# EAGLE design experiment (EAGLE 9.2.1)

## Sheet 1 of 2

## Sheet 2 of 2
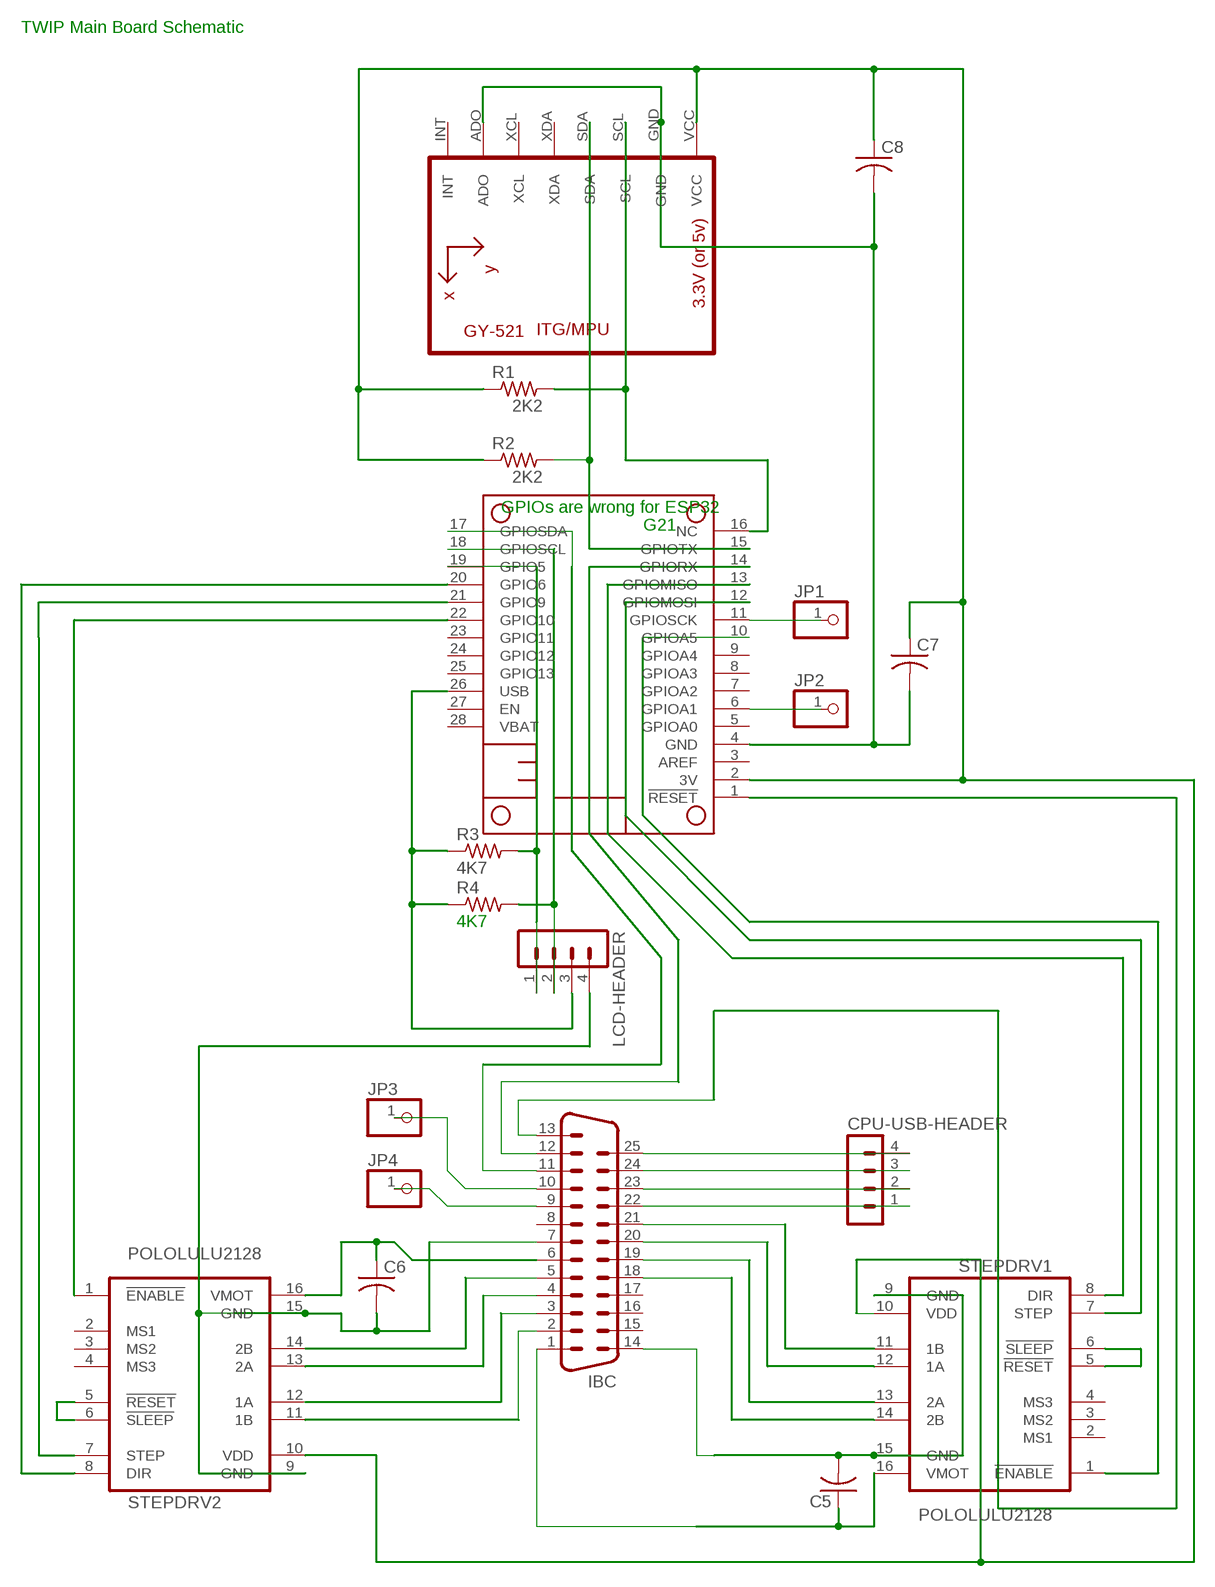
[diagram p0: schematic, sheet 2]

### Parts
C5  C-US050-024X044  [C050-024X044]
C6  C-US050-024X044  [C050-024X044]
C7  C-US050-024X044  [C050-024X044]
C8  C-US050-024X044  [C050-024X044]
CPU-USB-HEADER  MA04-1  [MA04-1]
IBC  M25VP  [M25VP]
JP1  PINHD-1X1  [1X01]
JP2  PINHD-1X1  [1X01]
JP3  PINHD-1X1  [1X01]
JP4  PINHD-1X1  [1X01]
LCD-HEADER  MA04-1  [MA04-1]
MS2  FEATHERWING_NOHOLES  [FEATHERWING_NOHOLES]
R1  2K2  R-US_0309/12  [0309/12]
R2  2K2  R-US_0309/12  [0309/12]
R3  4K7  R-US_0309/12  [0309/12]
R4  4K7  R-US_0309/12  [0309/12]
STEPDRV1  POLOLULU2128  [POLOLULU2128]
STEPDRV2  POLOLULU2128  [POLOLULU2128]
U1  GY-521MPU6050  [GY-521]

### Nets
3V: C7.1 C8.1 MS2.2(3V) R1.1 R2.1 STEPDRV1.10(VDD) STEPDRV2.10(VDD) U1.VCC
N$2: C7.2 C8.2 MS2.4(GND) U1.ADO U1.GND
N$3: IBC.18 STEPDRV1.14(2B)
N$4: IBC.19 STEPDRV1.13(2A)
N$5: MS2.12(GPIOMOSI) STEPDRV1.7(STEP)
N$6: IBC.20 STEPDRV1.12(1A)
N$7: IBC.21 STEPDRV1.11(1B)
N$8: IBC.2 STEPDRV2.11(1B)
N$9: IBC.3 STEPDRV2.12(1A)
N$10: IBC.4 STEPDRV2.13(2A)
N$11: LCD-HEADER.1 MS2.19(GPIO5) R3.2
N$12: IBC.5 STEPDRV2.14(2B)
N$13: CPU-USB-HEADER.4 IBC.25
N$14: CPU-USB-HEADER.3 IBC.24
N$15: MS2.13(GPIOMISO) STEPDRV1.8(DIR)
N$16: IBC.13 MS2.1(!RESET)
N$17: MS2.16(NC) R1.2 U1.SCL
N$18: CPU-USB-HEADER.2 IBC.23
N$19: IBC.12 MS2.14(GPIORX)
N$20: C5.2 IBC.14 STEPDRV1.9(GND) STEPDRV1.15(GND)
N$21: C6.1 IBC.6 STEPDRV2.16(VMOT)
N$22: C5.1 IBC.1 STEPDRV1.16(VMOT)
N$23: STEPDRV1.5(!RESET) STEPDRV1.6(!SLEEP)
N$24: STEPDRV2.5(!RESET) STEPDRV2.6(!SLEEP)
N$25: MS2.15(GPIOTX) R2.2 U1.SDA
N$27: MS2.20(GPIO6) STEPDRV2.8(DIR)
N$28: IBC.11 MS2.17(GPIOSDA)
N$29: MS2.21(GPIO9) STEPDRV2.7(STEP)
N$30: CPU-USB-HEADER.1 IBC.22
N$31: MS2.10(GPIOA5) STEPDRV1.1(!ENABLE)
N$32: JP1.1 MS2.11(GPIOSCK)
N$33: C6.2 IBC.7 LCD-HEADER.4 STEPDRV2.9(GND) STEPDRV2.15(GND)
N$34: MS2.22(GPIO10) STEPDRV2.1(!ENABLE)
N$35: LCD-HEADER.2 MS2.18(GPIOSCL) R4.2
N$36: JP2.1 MS2.6(GPIOA1)
N$37: IBC.10 JP3.1
N$38: IBC.9 JP4.1
USB: LCD-HEADER.3 MS2.26(USB) R3.1 R4.1
Unconnected: IBC.8 IBC.15 IBC.16 IBC.17 IBC.G1 IBC.G2 MS2.3(AREF) MS2.5(GPIOA0) MS2.7(GPIOA2) MS2.8(GPIOA3) MS2.9(GPIOA4) MS2.23(GPIO11) MS2.24(GPIO12) MS2.25(GPIO13) MS2.27(EN) MS2.28(VBAT) STEPDRV1.2(MS1) STEPDRV1.3(MS2) STEPDRV1.4(MS3) STEPDRV2.2(MS1) STEPDRV2.3(MS2) STEPDRV2.4(MS3) U1.INT U1.XCL U1.XDA

### Notes on the sheet
- TWIP Main Board Schematic
- GPIOs are wrong for ESP32
- G21

## Library data of the parts
C5-C8 = rcl:C-US: CAPACITOR, American symbol; SPICEPREFIX: C
CPU-USB-HEADER LCD-HEADER = con-lstb:MA04-1: PIN HEADER; OC_FARNELL: unknown; OC_NEWARK: unknown
IBC = con-subd:M25VP: SUB-D; OC_FARNELL: unknown; OC_NEWARK: unknown
JP1-JP4 = pinhead:PINHD-1X1: PIN HEADER
MS2 = microbuilder:FEATHERWING
R1-R4 = resistor:R-US_: RESISTOR, American symbol
STEPDRV1 STEPDRV2 = stepper_drivers_etc:POLOLULU2128
U1 = gy-521:GY-521

## Board
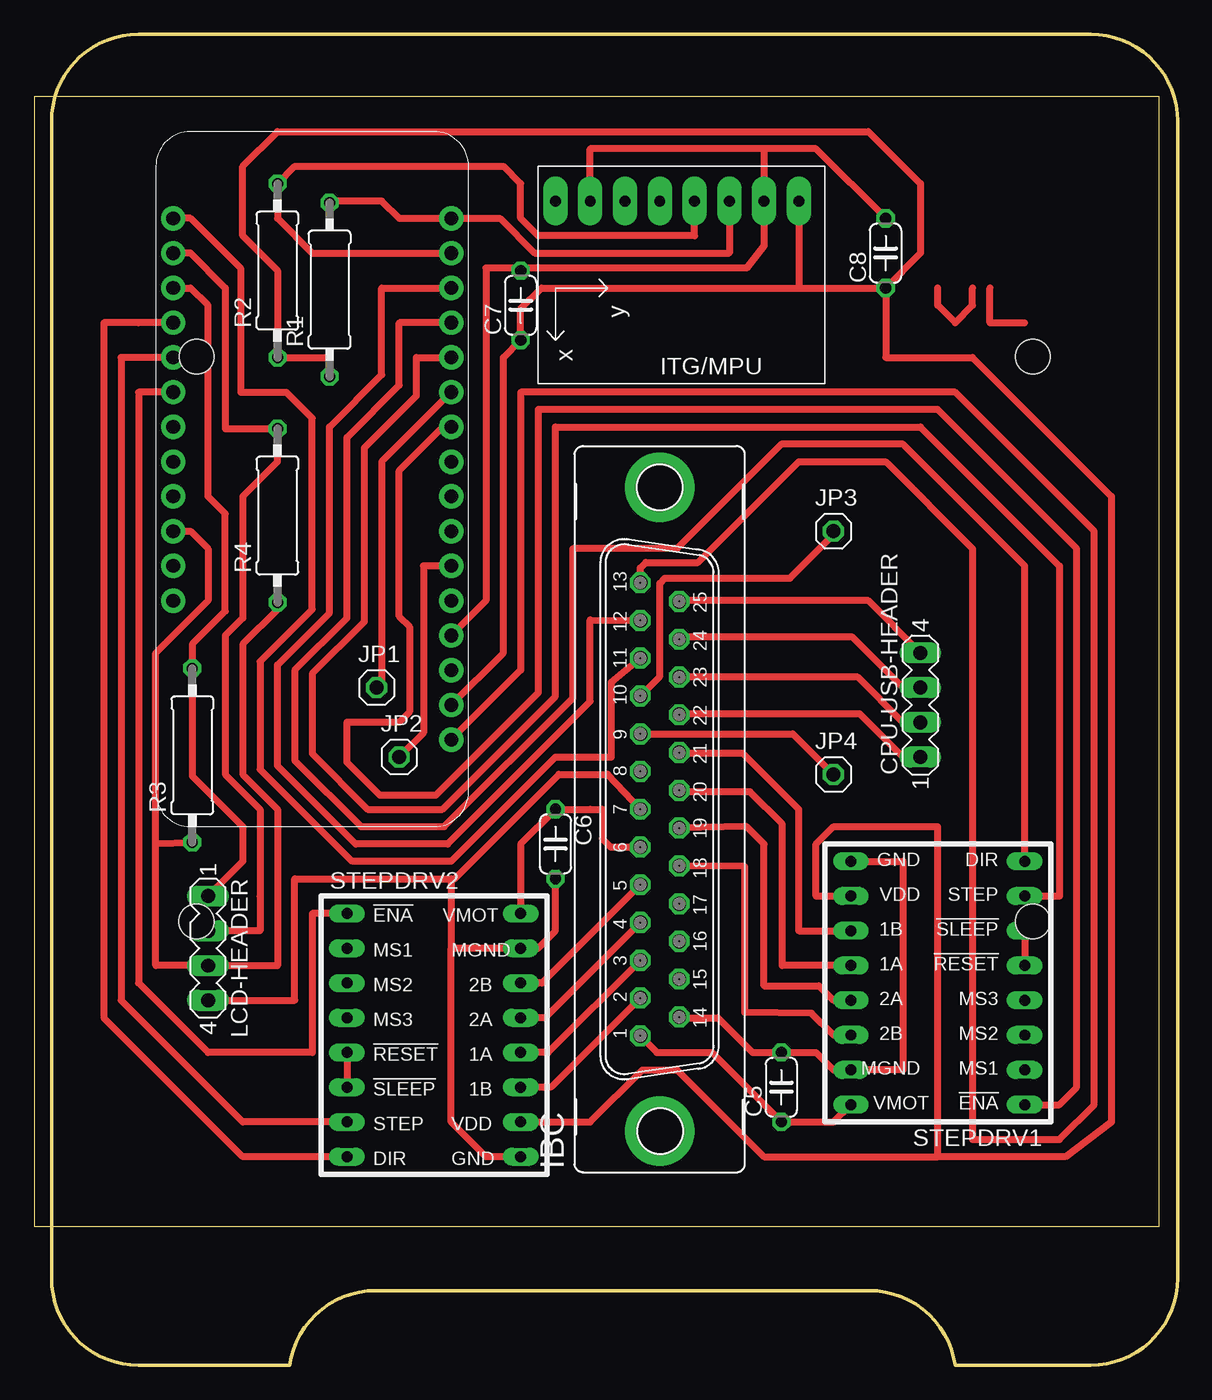
[diagram p1: board, top side]

Size 83.57 x 97.28 mm. Coordinates in mm from the lower left corner, seen from the top.
Outline: 83.57,90.93 arc90 77.22,97.28 7.62,97.28 arc90 1.27,90.93 1.27,6.35 arc90 7.62,0 18.67,0 arc-82 24.96,5.46 61.02,5.46 arc-82 67.31,0 77.22,0 arc90 83.57,6.35 83.57,90.93
Outline: 0,10.16 82.22,10.16 82.22,92.7 0,92.7 0,10.16
Copper layers (1*16): Top 0.035mm / dielectric 1.5mm / Bottom 0.035mm
Design rules "default": minimum track width 6mil, minimum drill 0.35mm, track to track 6mil, track to pad 6mil, pad to pad 6mil, via to via 6mil, smd to smd 6mil, copper to edge 40mil, drill to drill 6mil, minimum pad ring 10mil, minimum via ring 8mil, stop-mask expansion 4mil, vias tented up to drill 0mil, thermal gap 10mil
Holes 2.54 mm at 72.98,73.72 72.98,32.45 11.86,32.45 11.87,73.72

### Footprints (pad centres in the part's own frame; a part is rotated, then mirrored left to right if it is on the bottom)
C050-024X044 = drill 0.813 octagon: 1 -2.54,0; 2 2.54,0
MA04-1 = drill 1.016 long: 1 -3.81,0; 2 -1.27,0; 3 1.27,0; 4 3.81,0
M25VP = drill 1.016 octagon: 1 -16.561,1.422; 2 -13.792,1.422; 3 -11.049,1.422; 4 -8.28,1.422; 5 -5.512,1.422; 6 -2.769,1.422; 7 0,1.422; 8 2.769,1.422; 9 5.512,1.422; 10 8.28,1.422; 11 11.049,1.422; 12 13.792,1.422; 13 16.561,1.422; 14 -15.189,-1.422; 15 -12.421,-1.422; 16 -9.652,-1.422; 17 -6.909,-1.422; 18 -4.14,-1.422; 19 -1.372,-1.422; 20 1.372,-1.422; 21 4.14,-1.422; 22 6.909,-1.422; 23 9.652,-1.422; 24 12.421,-1.422; 25 15.189,-1.422 | drill 3.302 pad 5.08: G1 -23.52,0; G2 23.52,0
1X01 = drill 1.016 octagon: 1 0,0
FEATHERWING_NOHOLES = drill 1 pad 1.778: 1 6.35,1.27; 2 8.89,1.27; 3 11.43,1.27; 4 13.97,1.27; 5 16.51,1.27; 6 19.05,1.27; 7 21.59,1.27; 8 24.13,1.27; 9 26.67,1.27; 10 29.21,1.27; 11 31.75,1.27; 12 34.29,1.27; 13 36.83,1.27; 14 39.37,1.27; 15 41.91,1.27; 16 44.45,1.27; 17 44.45,21.59; 18 41.91,21.59; 19 39.37,21.59; 20 36.83,21.59; 21 34.29,21.59; 22 31.75,21.59; 23 29.21,21.59; 24 26.67,21.59; 25 24.13,21.59; 26 21.59,21.59; 27 19.05,21.59; 28 16.51,21.59
0309/12 = drill 0.813 octagon: 1 -6.35,0; 2 6.35,0
POLOLULU2128 = drill 0.8 long: 1 -7.62,7.62; 2 -7.62,5.08; 3 -7.62,2.54; 4 -7.62,0; 5 -7.62,-2.54; 6 -7.62,-5.08; 7 -7.62,-7.62; 8 -7.62,-10.16; 9 5.08,-10.16; 10 5.08,-7.62; 11 5.08,-5.08; 12 5.08,-2.54; 13 5.08,0; 14 5.08,2.54; 15 5.08,5.08; 16 5.08,7.62
GY-521 = drill 0.8 pad 1.778 long: ADO -8.89,-6.35; GND -8.89,6.35; INT -8.89,-8.89; SCL -8.89,3.81; SDA -8.89,1.27; VCC -8.89,8.89; XCL -8.89,-3.81; XDA -8.89,-1.27

### Placement (x,y rotation side)
C5  54.61,20.32 90 top
C6  38.1,38.1 270 top
C7  35.56,77.47 90 top
C8  62.23,81.28 90 top
CPU-USB-HEADER  64.77,48.26 90 top
IBC  45.72,40.64 90 top
JP1  25.02,49.53 0 top
JP2  26.67,44.45 0 top
JP3  58.42,60.96 0 top
JP4  58.42,43.18 0 top
LCD-HEADER  12.7,30.48 270 top
MS2  31.75,39.37 90 top
R1  21.59,78.61 90 top
R2  17.78,80.01 90 top
R3  11.56,44.58 90 top
R4  17.78,62.1 90 top
STEPDRV1  64.77,26.67 180 top
STEPDRV2  30.48,25.4 0 top
U1  46.99,76.2 270 top

### Tracks (layer width: path | path; a pad name or v marks a point on that pad's centre or on a via)
3V
  Top 0.508: 66.04,15.24 75.35,15.24 78.74,17.78 78.74,63.5 68.58,73.66 62.23,73.66 C8.1 | 66.04,15.24 66.04,39.37 58.42,39.37 57.15,38.1 57.15,34.29 STEPDRV1.10 | 66.04,15.24 53.34,15.24 46.99,21.59 44.45,21.59 40.64,17.78 STEPDRV2.10 | 55.88,78.74 C8.1 | U1.VCC 55.88,78.74 | 55.88,78.74 37.08,78.74 35.56,77.22 C7.1 34.29,73.66 34.29,52.07 MS2.2 | C8.1 64.77,81.28 64.77,86.36 60.96,90.17 17.78,90.17 15.24,87.63 15.24,82.55 17.78,80.01 R2.1 21.59,73.66 R1.1
N$1
  Top 0.508: 68.58,78.74 68.58,77.47 67.31,76.2 66.04,77.47 66.04,78.74
N$2
  Top 0.508: 53.34,88.9 U1.GND 53.34,81.82 52.07,80.19 35.56,80.19 | MS2.4 33.02,55.88 33.02,80.19 35.56,80.19 | 53.34,88.9 40.64,88.9 U1.ADO | C8.2 57.15,88.9 53.34,88.9 | C7.2 35.56,80.19
N$3
  Top 0.508: STEPDRV1.14 58.42,24.13 56.82,25.73 51.94,25.78 51.94,36.45 IBC.18
N$4
  Top 0.508: STEPDRV1.13 58.42,26.67 57.35,27.74 53.34,27.74 53.34,38.1 52.07,39.37 IBC.19
N$5
  Top 0.508: STEPDRV1.7 74.93,34.29 74.93,58.42 64.77,68.58 38.1,68.58 38.1,48.9 29.84,40.64 24.38,40.64 20.32,44.7 20.32,50.55 24.13,54.36 24.13,67.06 27.94,70.87 27.94,73.66 MS2.12
N$6
  Top 0.508: STEPDRV1.12 54.69,29.21 54.69,39.55 52.32,41.91 47.24,41.91 IBC.20
N$7
  Top 0.508: STEPDRV1.11 55.88,31.75 55.88,40.64 51.82,44.7 47.22,44.7 IBC.21
N$8
  Top 0.508: IBC.2 37.77,20.32 STEPDRV2.11
N$9
  Top 0.508: IBC.3 37.57,22.86 STEPDRV2.12
N$10
  Top 0.508: IBC.4 37.34,25.4 STEPDRV2.13
N$11
  Top 0.508: MS2.19 11.43,78.74 12.7,77.47 12.7,63.5 13.97,62.23 13.97,55.12 11.56,52.7 R3.2 11.56,43.05 15.24,39.37 15.24,36.83 LCD-HEADER.1
N$12
  Top 0.508: STEPDRV2.14 36.83,27.94 37.11,27.94 IBC.5
N$13
  Top 0.152: 47.19,55.88 IBC.25
  Top 0.508: CPU-USB-HEADER.4 60.96,55.88 47.19,55.88
N$14
  Top 0.152: 47.3,53.21 IBC.24
  Top 0.508: CPU-USB-HEADER.3 63.5,49.53 59.82,53.21 47.3,53.21
N$15
  Top 0.508: MS2.13 26.67,76.2 26.67,71.63 22.86,67.82 22.86,54.61 19.05,50.8 19.05,44.2 23.88,39.37 29.97,39.37 39.37,48.77 39.37,59.69 46.99,59.69 54.61,67.31 63.5,67.31 72.39,58.42 STEPDRV1.8
N$16
  Top 0.508: MS2.1 35.56,50.8 35.56,71.12 67.31,71.12 77.47,60.96 77.47,19.05 74.93,16.51 68.58,16.51 68.58,59.69 62.23,66.04 55.88,66.04 48.51,58.67 44.7,58.67 44.3,58.27 IBC.13
N$17
  Top 0.152: 21.59,85.09 R1.2
  Top 0.508: U1.SCL 50.8,81.28 36.58,81.28 34.04,83.82 MS2.16 26.67,83.82 25.4,85.09 21.59,85.09
N$18
  Top 0.508: CPU-USB-HEADER.2 63.5,46.99 60.2,50.29 IBC.23
N$19
  Top 0.508: MS2.14 25.4,78.74 25.4,72.39 21.59,68.58 21.59,54.99 17.78,51.18 17.78,43.81 23.5,38.1 30.23,38.1 40.64,48.51 40.64,54.48 IBC.12
N$20
  Top 0.508: STEPDRV1.9 63.5,36.83 63.5,21.59 STEPDRV1.15 58.42,21.59 57.15,22.86 C5.2 52.5,22.86 49.96,25.4 47.19,25.4 IBC.14
N$21
  Top 0.508: STEPDRV2.16 35.56,38.1 C6.1 40.64,40.64 | 40.64,40.64 41.53,40.64 41.53,38.48 42.14,37.87 IBC.6 | 40.64,40.64
N$22
  Top 0.508: STEPDRV1.16 58.42,17.78 C5.1 49.53,22.86 45.52,22.86 IBC.1
N$23
  Top 0.508: STEPDRV1.6 STEPDRV1.5
N$24
  Top 0.508: STEPDRV2.5 STEPDRV2.6
N$25
  Top 0.508: MS2.15 20.32,81.28 17.78,83.82 R2.2 19.05,87.63 34.29,87.63 35.56,86.36 35.56,83.82 36.83,82.55 48.26,82.55 U1.SDA
N$26
  Top 0.508: 69.85,78.74 69.85,76.2 72.39,76.2
N$27
  Top 0.508: STEPDRV2.8 15.24,15.24 5.08,25.4 5.08,76.2 7.62,76.2 MS2.20
N$28
  Top 0.508: MS2.17 11.43,83.82 15.11,80.14 15.11,71.12 18.41,71.12 20.32,69.22 20.32,55.24 16.51,51.44 16.51,43.56 23.24,36.83 30.48,36.83 38.1,44.45 42.16,44.45 42.16,49.91 IBC.11
N$29
  Top 0.508: STEPDRV2.7 15.24,17.78 6.35,26.67 6.35,73.66 MS2.21
N$30
  Top 0.152: IBC.22 47.22,47.62
  Top 0.508: CPU-USB-HEADER.1 63.5,44.45 60.33,47.62 47.22,47.62
N$31
  Top 0.508: MS2.10 29.84,68.58 26.67,65.41 26.67,54.74 27.43,53.98 27.43,47.75 26.67,46.99 22.86,46.99 22.86,44.07 25.27,41.66 29.34,41.66 36.83,49.15 36.83,69.85 66.04,69.85 76.2,59.69 76.2,20.32 74.93,19.05 STEPDRV1.1
N$32
  Top 0.508: MS2.11 25.4,66.04 25.4,49.91 JP1.1
N$33
  Top 0.508: LCD-HEADER.4 19.05,26.67 19.05,35.56 30.48,35.56 | 30.48,35.56 30.48,30.48 | 30.48,30.48 30.48,17.78 33.02,15.24 STEPDRV2.9 | C6.2 38.1,31.75 36.83,30.48 STEPDRV2.15 30.48,30.48 | 30.48,35.56 30.73,35.56 38.35,43.18 41.91,43.18 IBC.7
N$34
  Top 0.508: STEPDRV2.1 20.32,33.02 20.32,22.86 12.7,22.86 7.62,27.94 7.62,71.12 MS2.22
N$35
  Top 0.508: MS2.18 11.43,81.28 13.97,78.74 13.97,68.45 R4.2 17.78,66.04 15.24,63.5 15.24,54.61 13.97,53.34 13.97,43.18 16.51,40.64 16.51,34.29 16.51,31.75 LCD-HEADER.2
N$36
  Top 0.508: MS2.6 28.45,58.42 28.45,46.23 JP2.1
N$37
  Top 0.508: IBC.10 45.72,50.34 45.72,57.15 46.1,57.53 55.25,57.53 58.42,60.71 JP3.1
N$38
  Top 0.508: IBC.9 55.45,46.15 JP4.1
USB
  Top 0.508: 8.89,38.14 8.89,29.21 LCD-HEADER.3 17.78,29.21 17.78,40.64 15.24,43.18 15.24,52.7 17.78,55.24 R4.1 | 8.89,38.14 8.89,52.07 12.7,55.88 12.7,59.69 11.43,60.96 MS2.26 | 8.89,38.14 R3.1
(copper drawn outside any net)
  shapes: Top area x2